# EAGLE design USB Micro Connector Breakout Board (EAGLE 6.2)
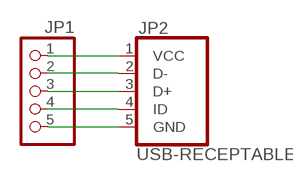
[diagram p0: schematic, sheet 1]

## Parts
JP1  PINHD-1X5  [1X05]
JP2  USB-RECEPTABLE  [FCI-10103594-0001LF]

## Nets
GND: JP1.4 JP2.4(ID)
N$1: JP1.1 JP2.1(VCC)
N$2: JP1.2 JP2.2(D-)
N$3: JP1.3 JP2.3(D+)
N$5: JP1.5 JP2.5(GND)

## Library data of the parts
JP1 = pinhead:PINHD-1X5: PIN HEADER
JP2 = daspilker:USB-RECEPTABLE: USB Receptable

## Board
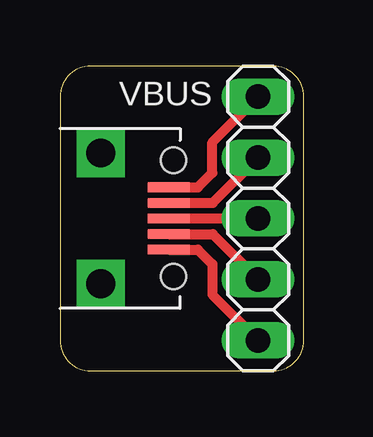
[diagram p1: board, top side]

Size 10.16 x 12.7 mm. Coordinates in mm from the lower left corner, seen from the top.
Outline: 1.27,12.7 arc90 0,11.43 0,1.27 arc90 1.27,0 8.89,0 arc90 10.16,1.27 10.16,11.43 arc90 8.89,12.7 1.27,12.7
Copper layers (1*16): Top 0.0356mm / dielectric 1.5011mm / Bottom 0.0356mm
Design rules: minimum track width 6mil, minimum drill 13mil, track to track 6mil, track to pad 6mil, pad to pad 6mil, via to via 6mil, smd to smd 6mil, copper to edge 15mil, drill to drill 6mil, minimum pad ring 7mil, minimum via ring 7mil, stop-mask expansion 4mil, vias tented up to drill 0mil, thermal gap 10mil

### Footprints (pad centres in the part's own frame; a part is rotated, then mirrored left to right if it is on the bottom)
1X05 = drill 1.016 long: 1 -5.08,0; 2 -2.54,0; 3 0,0; 4 2.54,0; 5 5.08,0
FCI-10103594-0001LF = smd 0.4 x 1.75: 1 -1.3,4.525; 2 -0.65,4.525; 3 0,4.525; 4 0.65,4.525; 5 1.3,4.525 | drill 1.2 pad 2 square: P$3 -2.725,1.7; P$4 2.725,1.7 | hole 1.05: -2.425,4.73; 2.425,4.73

### Placement (x,y rotation side)
JP1  8.26,6.35 270 top
JP2  0,6.35 270 top

### Tracks (layer width: path | path; a pad name or v marks a point on that pad's centre or on a via)
GND
  Top 0.406: JP2.4 6.37,5.7 JP1.4
N$1
  Top 0.406: JP2.1 5.75,7.65 6.35,8.26 6.35,9.53 JP1.1
N$2
  Top 0.406: JP2.2 6.37,7 JP1.2
N$3
  Top 0.406: JP2.3 JP1.3
N$5
  Top 0.406: JP2.5 5.75,5.05 6.35,4.45 6.35,3.17 JP1.5

### Text on the board
tNames: VBUS
bNames: VBUS | Rev. A1